# Altium schematic sheet Hierarchical Design.SchDoc
size Letter; DrawnBy: Aidan Gratton; Organization: UW Robotics; Address1: 200 University Avenue; Address2: Waterloo; Address3: Ontario; Address4: Canada N2L 3G6
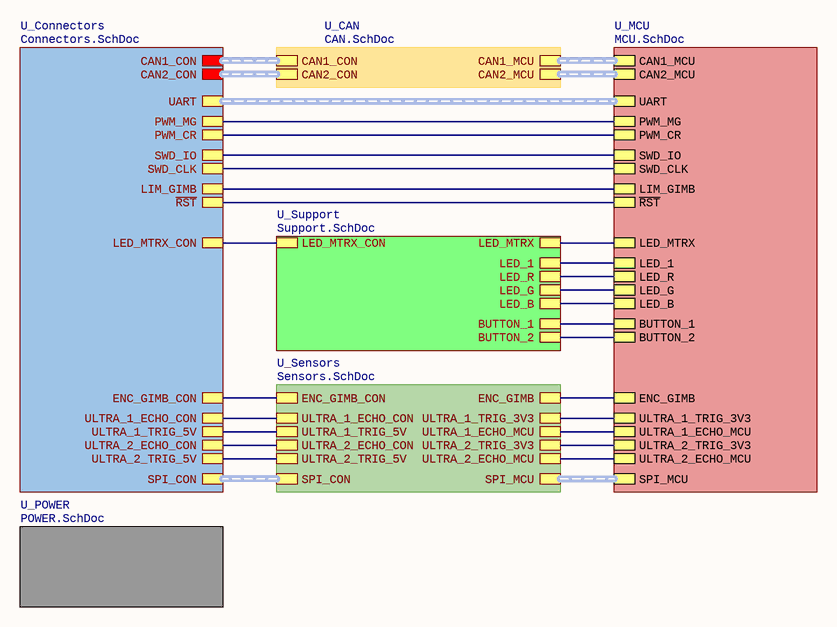
[diagram p0: Hierarchical Design.SchDoc]

## Sub-sheets
U_CAN = CAN.SchDoc: CAN1_CON (harness CAN1), CAN2_CON (harness CAN2), CAN2_MCU (harness CAN2_MCU), CAN1_MCU (harness CAN1_MCU)
U_Connectors = Connectors.SchDoc: ~{RST}, LIM_GIMB, LED_MTRX_CON, CAN1_CON (harness CAN1), CAN2_CON (harness CAN2), UART (harness UART), SPI_CON (harness SPI_CON), ENC_GIMB_CON, ULTRA_1_ECHO_CON, ULTRA_1_TRIG_5V, ULTRA_2_ECHO_CON, ULTRA_2_TRIG_5V, PWM_MG, PWM_CR, SWD_IO, SWD_CLK
U_MCU = MCU.SchDoc: ~{RST}, ENC_GIMB, LIM_GIMB, UART (harness UART), CAN1_MCU (harness CAN1_MCU), CAN2_MCU (harness CAN2_MCU), SPI_MCU (harness SPI_MCU), LED_MTRX, ULTRA_1_TRIG_3V3, ULTRA_1_ECHO_MCU, ULTRA_2_TRIG_3V3, ULTRA_2_ECHO_MCU, LED_1, LED_R, LED_G, LED_B, BUTTON_1, BUTTON_2, PWM_MG, PWM_CR, SWD_IO, SWD_CLK
U_POWER = POWER.SchDoc: no entries
U_Sensors = Sensors.SchDoc: ENC_GIMB, SPI_MCU (harness SPI_MCU), SPI_CON (harness SPI_CON), ENC_GIMB_CON, ULTRA_1_TRIG_3V3, ULTRA_1_ECHO_MCU, ULTRA_2_TRIG_3V3, ULTRA_2_ECHO_MCU, ULTRA_1_ECHO_CON, ULTRA_1_TRIG_5V, ULTRA_2_ECHO_CON, ULTRA_2_TRIG_5V
U_Support = Support.SchDoc: LED_MTRX, LED_MTRX_CON, LED_1, LED_R, LED_G, LED_B, BUTTON_1, BUTTON_2

## Nets
(unnamed): sheet U_Connectors/~{RST}, sheet U_MCU/~{RST}
(unnamed): sheet U_Connectors/LIM_GIMB, sheet U_MCU/LIM_GIMB
(unnamed): sheet U_Connectors/LED_MTRX_CON, sheet U_Support/LED_MTRX_CON
(unnamed): sheet U_Connectors/ENC_GIMB_CON, sheet U_Sensors/ENC_GIMB_CON
(unnamed): sheet U_Connectors/ULTRA_1_ECHO_CON, sheet U_Sensors/ULTRA_1_ECHO_CON
(unnamed): sheet U_Connectors/ULTRA_1_TRIG_5V, sheet U_Sensors/ULTRA_1_TRIG_5V
(unnamed): sheet U_Connectors/ULTRA_2_ECHO_CON, sheet U_Sensors/ULTRA_2_ECHO_CON
(unnamed): sheet U_Connectors/ULTRA_2_TRIG_5V, sheet U_Sensors/ULTRA_2_TRIG_5V
(unnamed): sheet U_Connectors/PWM_MG, sheet U_MCU/PWM_MG
(unnamed): sheet U_Connectors/PWM_CR, sheet U_MCU/PWM_CR
(unnamed): sheet U_Connectors/SWD_IO, sheet U_MCU/SWD_IO
(unnamed): sheet U_Connectors/SWD_CLK, sheet U_MCU/SWD_CLK
(unnamed): sheet U_MCU/ENC_GIMB, sheet U_Sensors/ENC_GIMB
(unnamed): sheet U_MCU/LED_MTRX, sheet U_Support/LED_MTRX
(unnamed): sheet U_MCU/ULTRA_1_TRIG_3V3, sheet U_Sensors/ULTRA_1_TRIG_3V3
(unnamed): sheet U_MCU/ULTRA_1_ECHO_MCU, sheet U_Sensors/ULTRA_1_ECHO_MCU
(unnamed): sheet U_MCU/ULTRA_2_TRIG_3V3, sheet U_Sensors/ULTRA_2_TRIG_3V3
(unnamed): sheet U_MCU/ULTRA_2_ECHO_MCU, sheet U_Sensors/ULTRA_2_ECHO_MCU
(unnamed): sheet U_MCU/LED_1, sheet U_Support/LED_1
(unnamed): sheet U_MCU/LED_R, sheet U_Support/LED_R
(unnamed): sheet U_MCU/LED_G, sheet U_Support/LED_G
(unnamed): sheet U_MCU/LED_B, sheet U_Support/LED_B
(unnamed): sheet U_MCU/BUTTON_1, sheet U_Support/BUTTON_1
(unnamed): sheet U_MCU/BUTTON_2, sheet U_Support/BUTTON_2

## Buses and harness runs
harness sheet U_CAN/CAN1_CON = sheet U_Connectors/CAN1_CON
harness sheet U_CAN/CAN1_MCU = sheet U_MCU/CAN1_MCU
harness sheet U_CAN/CAN2_CON = sheet U_Connectors/CAN2_CON
harness sheet U_CAN/CAN2_MCU = sheet U_MCU/CAN2_MCU
harness sheet U_Connectors/SPI_CON = sheet U_Sensors/SPI_CON
harness sheet U_Connectors/UART = sheet U_MCU/UART
harness sheet U_MCU/SPI_MCU = sheet U_Sensors/SPI_MCU

## Notes on the sheet
- Title
- Size:
- Date:
- Letter
- Drawn By:
- Sheet
- of
- File: